# Altium schematic sheet Switch.SchDoc
size A4
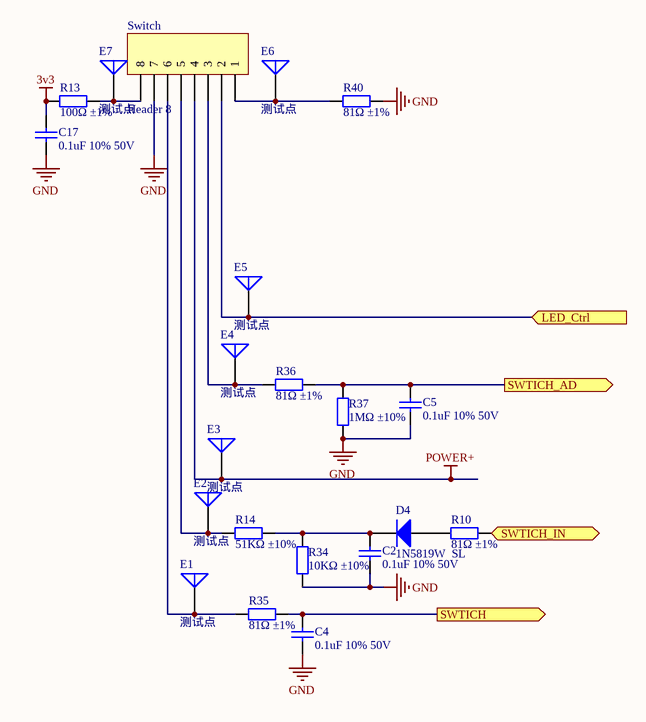
[diagram p0: Switch.SchDoc]

## Parts
C2  0.1uF 10% 50V  [0603_C]
C4  0.1uF 10% 50V  [0603_C]
C5  0.1uF 10% 50V  [0603_C]
C17  0.1uF 10% 50V  [0603_C]
D4  1N5819W  SL  [SOD-123]
E1  测试点  [Test]
E2  测试点  [Test]
E3  测试点  [Test]
E4  测试点  [Test]
E5  测试点  [Test]
E6  测试点  [Test]
E7  测试点  [Test]
R10  81Ω ±1%  [0603_R]
R13  100Ω ±1%  [0603_R]
R14  51KΩ ±10%  [0603_R]
R34  10KΩ ±10%  [0603_R]
R35  81Ω ±1%  [0603_R]
R36  81Ω ±1%  [0603_R]
R37  1MΩ ±10%  [0603_R]
R40  81Ω ±1%  [0603_R]
Switch  Header 8  [SH1.0mm-8P]

## Ports
LED_Ctrl (in), SWTICH (out), SWTICH_AD (out), SWTICH_IN (in)

## Nets
3v3: C17.2 R13.1
GND: C2.1 C4.1 C5.1 C17.1 R34.1 R37.1 R40.2 Switch.7
POWER+: E3.1(A) Switch.4
LED_Ctrl: E5.1(A) Switch.2 ; port LED_Ctrl
SWTICH: C4.2 R35.2 ; port SWTICH
SWTICH_AD: C5.2 R36.2 R37.2 ; port SWTICH_AD
SWTICH_IN: R10.2 ; port SWTICH_IN
NetC2_2: C2.2 D4.2(K) R14.2 R34.2
NetD4_1: D4.1(A) R10.1
NetE1_1: E1.1(A) R35.1 Switch.6
NetE2_1: E2.1(A) R14.1 Switch.5
NetE4_1: E4.1(A) R36.1 Switch.3
NetE6_1: E6.1(A) R40.1 Switch.1
NetE7_1: E7.1(A) R13.2 Switch.8

## Library data of the parts
C2 C4 C5 C17 = 0603 4.7uF (475) 10% 16V: 贴片电容; ComponentLink1Description: 供应商链接; ComponentLink1URL: http://www.szlcsc.com/product/details_20375.html; Package: 0603; Supplier: LC; SuppliersPartNumber: C19666
D4 = SOD-123 B5819W  SL: 肖特基二极管; ComponentLink1Description: 供应商链接; ComponentLink1URL: http://www.szlcsc.com/product/details_9093.html; Package: SOD-123; Supplier: LC; SuppliersPartNumber: C8598
E1-E7 = Antenna: Generic Antenna; Published: 24-Mar-1999; LatestRevisionDate: 17-Jul-2002; LatestRevisionNote: Re-released for DXP Platform.; PackageReference: PIN1; Publisher: Altium Limited
R10 R13 R14 R34-R37 R40 = 0603 2.2Ω (2R20) 1%: 贴片电阻; ComponentLink1Description: 供应商链接; ComponentLink1URL: http://www.szlcsc.com/product/details_23666.html; Package: 0603; Supplier: LC; SuppliersPartNumber: C22939
Switch = Header 8: Header, 8-Pin; LatestRevisionDate: 17-Jul-2002; LatestRevisionNote: Re-released for DXP Platform.; Publisher: Altium Limited